# EAGLE design usb_hub (EAGLE 9.6.0)
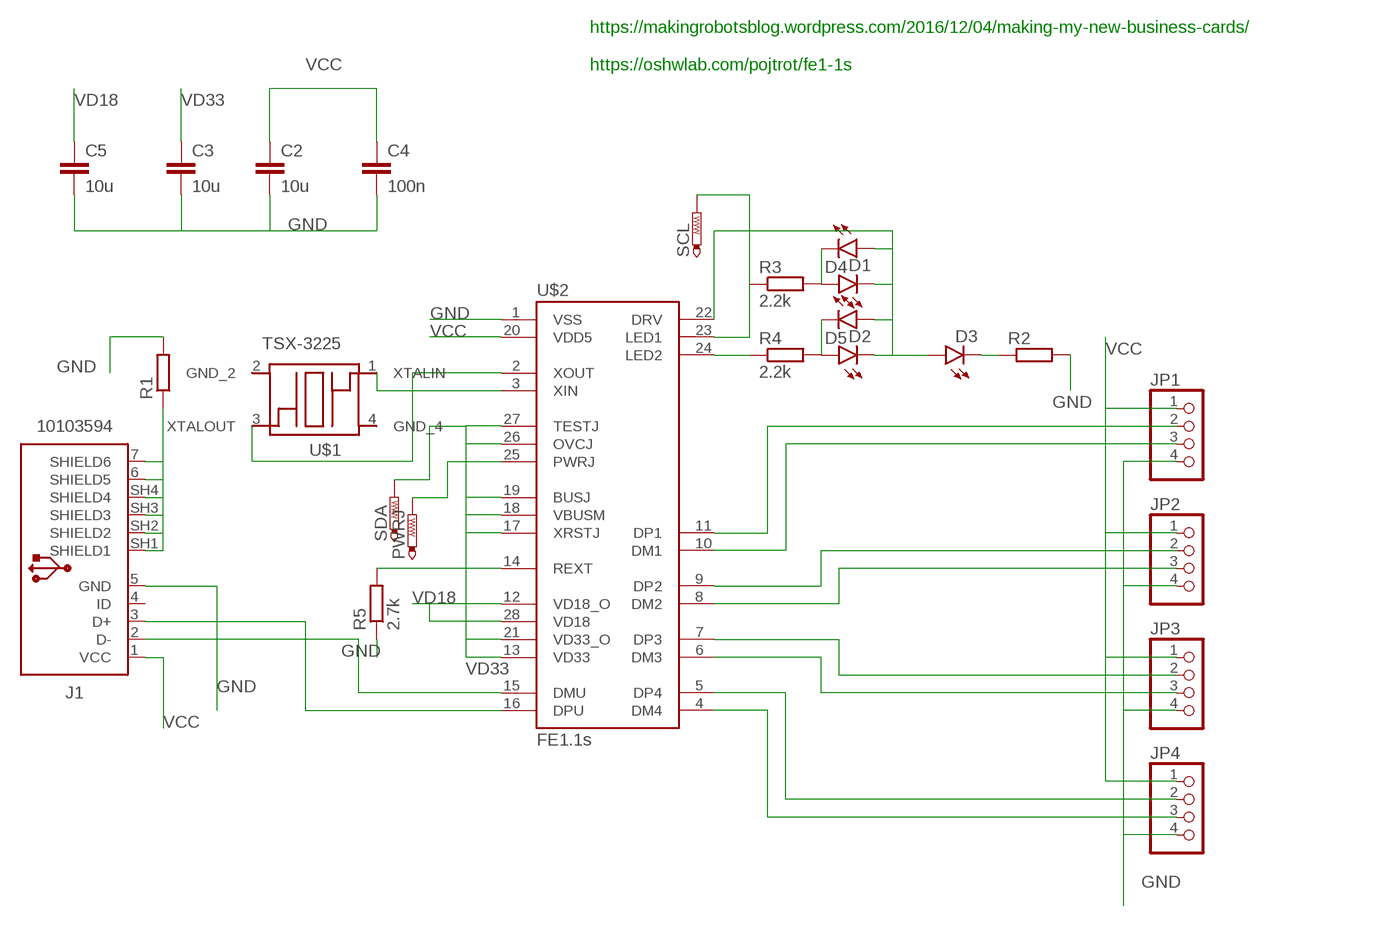
[diagram p0: schematic, sheet 1]

## Parts
C2  10u  C-EUC0805  [C0805]
C3  10u  C-EUC0805  [C0805]
C4  100n  C-EUC0603  [C0603]
C5  10u  C-EUC0805  [C0805]
D1  LEDCHIP-LED0603  [CHIP-LED0603]
D2  LEDCHIP-LED0603  [CHIP-LED0603]
D3  LEDCHIP-LED0603  [CHIP-LED0603]
D4  LEDCHIP-LED0603  [CHIP-LED0603]
D5  LEDCHIP-LED0603  [CHIP-LED0603]
J1  10103594  [10103594]
JP1  PINHD-1X4  [1X04]
JP2  PINHD-1X4  [1X04]
JP3  PINHD-1X4  [1X04]
JP4  PINHD-1X4  [1X04]
PWRJ  PTR1B1,27  [B1,27]
R1  R-EU_R0603  [R0603]
R2  R-EU_R0603  [R0603]
R3  2.2k  R-EU_R0603  [R0603]
R4  2.2k  R-EU_R0603  [R0603]
R5  2.7k  R-EU_R0603  [R0603]
SCL  PTR1B1,27  [B1,27]
SDA  PTR1B1,27  [B1,27]
U$1  TSX-3225  [TSX-3225]
U$2  FE1.1S  [FE1.1S_SSOP-28]

## Nets
GND: C2.2 C3.2 C4.2 C5.2 J1.5(GND) JP1.4 JP2.4 JP3.4 JP4.4 R1.2 R2.2 R5.1 U$2.1(VSS)
N$1: J1.3(D+) U$2.16(DPU)
N$2: J1.2(D-) U$2.15(DMU)
N$3: U$1.1(XTALIN) U$2.3(XIN)
N$4: U$1.3(XTALOUT) U$2.2(XOUT)
N$5: D1.A D4.C R3.2
N$7: D2.A D5.C R4.2
N$8: JP4.3 U$2.4(DM4)
N$9: JP4.2 U$2.5(DP4)
N$10: JP3.3 U$2.6(DM3)
N$11: JP3.2 U$2.7(DP3)
N$12: JP2.3 U$2.8(DM2)
N$13: JP2.2 U$2.9(DP2)
N$14: JP1.3 U$2.10(DM1)
N$15: JP1.2 U$2.11(DP1)
N$16: R4.1 U$2.24(LED2)
N$17: D3.C R2.1
N$18: R3.1 SCL.TP U$2.23(LED1)
N$19: D1.C D2.C D3.A D4.A D5.A U$2.22(DRV)
N$20: PWRJ.TP U$2.25(PWRJ)
N$21: R5.2 U$2.14(REXT)
SHIELD2: J1.6(SHIELD5) J1.7(SHIELD6) J1.SH1(SHIELD1) J1.SH2(SHIELD2) J1.SH3(SHIELD3) J1.SH4(SHIELD4) R1.1
VCC: C2.1 C4.1 J1.1(VCC) JP1.1 JP2.1 JP3.1 JP4.1 U$2.20(VDD5)
VD18: C5.1 U$2.12(VD18_O) U$2.28(VD18)
VD33: C3.1 SDA.TP U$2.13(VD33) U$2.17(XRSTJ) U$2.18(VBUSM) U$2.19(BUSJ) U$2.21(VD33_O) U$2.26(OVCJ) U$2.27(TESTJ)
Unconnected: J1.4(ID) U$1.2(GND_2) U$1.4(GND_4)

## Notes on the sheet
- https://makingrobotsblog.wordpress.com/2016/12/04/making-my-new-business-cards/
  
  https://oshwlab.com/pojtrot/fe1-1s

## Library data of the parts
C2-C5 = rcl:C-EU: CAPACITOR, European symbol; SPICEPREFIX: C
D1-D5 = led:LED: LED OSRAM: - CHIPLED LG R971, LG N971, LY N971, LG Q971, LY Q971, LO R971, LY R971 LH N974, LH R974 LS Q976, LO Q976, LY Q976 LO Q996 - Hyper CHIPLED LW Q18S LB Q993, LB Q99A, LB R99A - SideLED LS A670, LO A670, LY A670, LG A670, LP A670 LB A673, LV A673, LT A673, LW A673 LH A674 LY A675 LS A676, LA A676, LO A676, LY A676, LW A676 LS A679, LY A679, LG A679 - Hyper Micro SIDELED® LS Y876, LA Y876, LO Y876, LY Y876 LT Y87S - SmartLED LW L88C, LW L88S LB L89C, LB L89S, LG L890 LS L89K, LO L89K, LY L89K LS L896, LA L896, LO L896, LY L896 - TOPLED LS T670, LO T670, LY T670, LG T670, LP T670 LSG T670, LSP T670, LSY T670, LOP T670, LYG T670 LG T671, LOG T671, LSG T671 LB T673, LV T673, LT T673, LW T673 LH T674 LS T676, LA T676, LO T676, LY T676, LB T676, LH T676, LSB T676, LW T676 LB T67C, LV T67C, LT T67C, LS T67K, LO T67K, LY T67K, LW E67C LS E67B, LA E67B, LO E67B, LY E67B, LB E67C, LV E67C, LT E67C LW T67C LS T679, LY T679, LG T679 LS T770, LO T770, LY T770, LG T770, LP T770 LB T773, LV T773, LT T773, LW T773 LH T774 LS E675, LA E675, LY E675, LS T675 LS T776, LA T776, LO T776, LY T776, LB T776 LHGB T686 LT T68C, LB T68C - Hyper Mini TOPLED® LB M676 - Mini TOPLED Santana® LG M470 LS M47K, LO M47K, LY M47K Source: http://www.osram.convergy.de LUXEON: - LUMILED® LXK2-PW12-R00, LXK2-PW12-S00, LXK2-PW14-U00, LXK2-PW14-V00 LXK2-PM12-R00, LXK2-PM12-S00, LXK2-PM14-U00 LXK2-PE12-Q00, LXK2-PE12-R00, LXK2-PE12-S00, LXK2-PE14-T00, LXK2-PE14-U00 LXK2-PB12-K00, LXK2-PB12-L00, LXK2-PB12-M00, LXK2-PB14-N00, LXK2-PB14-P00, LXK2-PB14-Q00 LXK2-PR12-L00, LXK2-PR12-M00, LXK2-PR14-Q00, LXK2-PR14-R00 LXK2-PD12-Q00, LXK2-PD12-R00, LXK2-PD12-S00 LXK2-PH12-R00, LXK2-PH12-S00 LXK2-PL12-P00, LXK2-PL12-Q00, LXK2-PL12-R00 Source: www.luxeon.com KINGBRIGHT: KA-3528ASYC Source: www.kingbright.com
J1 = Connector_USB:10103594: USB(2.0) Micro-B, RCPT, 5POS, SMD-THT-R/A Datasheet <https://cdn.amphenol-icc.com/media/wysiwyg/files/documentation/datasheet/inputoutput/io_usb_micro.pdf> Drawing <https://cdn.amphenol-icc.com/media/wysiwyg/files/drawing/10103594.pdf>; CATEGORY: Connectors; CONTACTS: 5; CURRENT-RATING: 1.8A; DESCRIPTION: CONN RCPT USB2.0 MICRO B SMD R/A; GENDER: Receptacle; MANUFACTURER: Amphenol ICC (FCI); MOUNT_TYPE: R/A; MPN: 10103594-0001LF; OPERATING_TEMPERATURE: -30°C ~ 80°C; PART_STATUS: ACTIVE; ROHS_COMPLIANT: COMPLIANT; SUB_CATEGORY: USB; TYPE: USB-micro B; VOLTAGE-RATING: 100VAC
JP1-JP4 = pinhead:PINHD-1X4: PIN HEADER
PWRJ SCL SDA = testpad:PTR1: TEST PIN
R1-R5 = rcl:R-EU_: RESISTOR, European symbol; SPICEPREFIX: R
U$1 = crystals:TSX-3225
U$2 = imcom:FE1.1S: A USB 2.0 hub IC. http://www.jfd-ic.com/Documents/FE1.1s%20Data%20Sheet%20%28Rev.%201.0%29.pdf

## Board
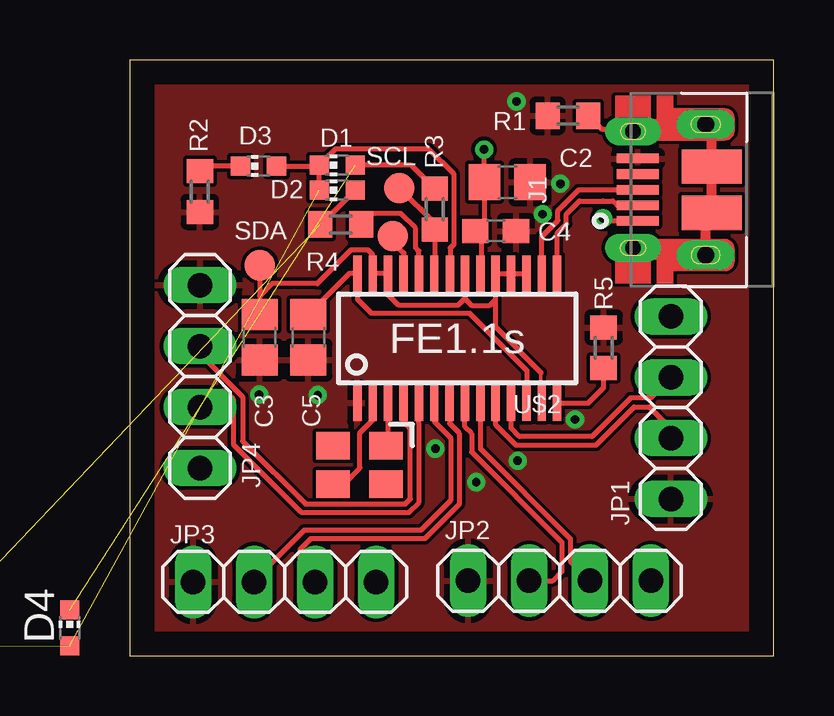
[diagram p1: board, top side]
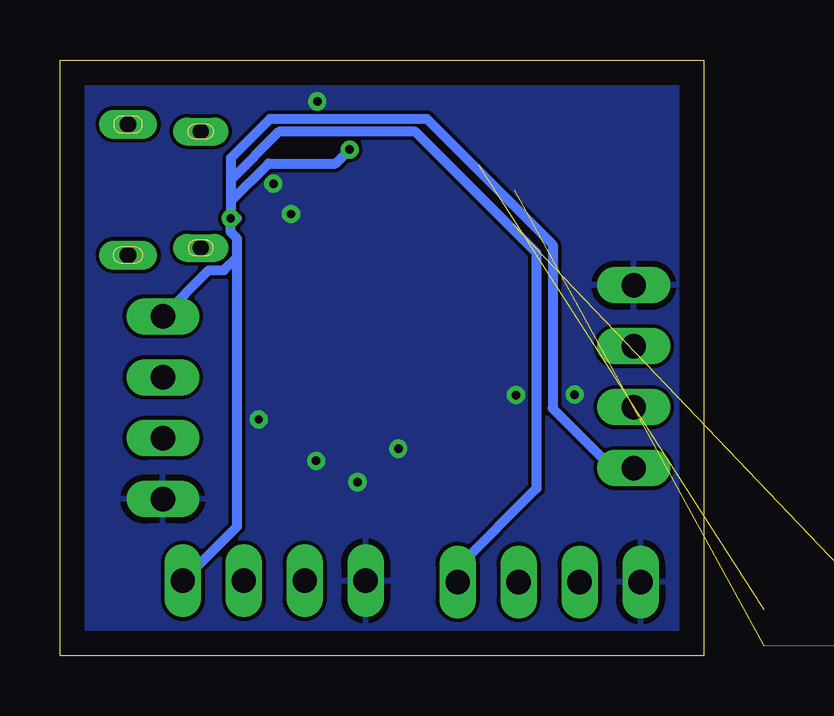
[diagram p2: board, bottom side, seen from below]

Size 26.82 x 24.84 mm. Coordinates in mm from the lower left corner, seen from the top.
Outline: 0,0 26.82,0 26.82,24.84 0,24.84 0,0
Copper layers (1*16): Top 0.035mm / dielectric 1.5mm / Bottom 0.035mm
Design rules "default": minimum track width 6mil, minimum drill 0.35mm, track to track 6mil, track to pad 6mil, pad to pad 6mil, via to via 6mil, smd to smd 6mil, copper to edge 40mil, drill to drill 6mil, minimum pad ring 10mil, minimum via ring 8mil, stop-mask expansion 4mil, vias tented up to drill 0mil, thermal gap 10mil

### Footprints (pad centres in the part's own frame; a part is rotated, then mirrored left to right if it is on the bottom)
C0805 = smd 1.3 x 1.5: 1 -0.95,0; 2 0.95,0
C0603 = smd 1.1 x 1: 1 -0.85,0; 2 0.85,0
CHIP-LED0603 = smd 0.8 x 0.8: A 0,-0.75; C 0,0.75
10103594 = smd 0.4 x 1.75: 1 -1.3,2.825; 2 -0.65,2.825; 3 0,2.825; 4 0.65,2.825; 5 1.3,2.825 | smd 1.425 x 2.5: 6 -0.963,-0.25; 7 0.963,-0.25 | drill 0.65 pad 0.73 long: SH1 -2.425,3.03; SH2 2.425,3.03 | drill 0.7 long: SH3 -2.725,0; SH4 2.725,0
1X04 = drill 1.016 long: 1 -3.81,0; 2 -1.27,0; 3 1.27,0; 4 3.81,0
B1,27 = smd 1.27 x 1.27: TP 0,0
R0603 = smd 1 x 1.1: 1 -0.85,0; 2 0.85,0
TSX-3225 = smd 1.4 x 1.15: 1 0,-1.6; 2 2.2,-1.6; 3 2.2,0; 4 0,0
FE1.1S_SSOP-28 = smd 0.35 x 1.5: 1 -4.16,-2.7; 2 -3.52,-2.7; 3 -2.88,-2.7; 4 -2.24,-2.7; 5 -1.6,-2.7; 6 -0.96,-2.7; 7 -0.32,-2.7; 8 0.32,-2.7; 9 0.96,-2.7; 10 1.6,-2.7; 11 2.24,-2.7; 12 2.88,-2.7; 13 3.52,-2.7; 14 4.16,-2.7; 15 4.16,2.7; 16 3.52,2.7; 17 2.88,2.7; 18 2.24,2.7; 19 1.6,2.7; 20 0.96,2.7; 21 0.32,2.7; 22 -0.3,2.7; 23 -0.96,2.7; 24 -1.6,2.7; 25 -2.24,2.7; 26 -2.88,2.7; 27 -3.52,2.7; 28 -4.16,2.7

### Placement (x,y rotation side)
C2  15.72,19.74 0 top
C3  5.4,13.28 270 top
C4  15.24,17.71 0 top
C5  7.44,13.28 270 top
D1  8.63,20.45 90 top
D2  8.63,19.41 90 top
D3  5.35,20.42 90 top
D4  -2.51,1.17 0 top
D5  -7.39,1.14 0 top  (outside the outline)
J1  23.99,19.43 90 top
JP1  22.54,10.34 270 top
JP2  17.9,3.13 180 top
JP3  6.44,3.08 180 top
JP4  2.92,11.64 90 top
PWRJ  10.95,17.5 0 top
R1  18.25,22.52 180 top
R2  2.91,19.35 270 top
R3  12.7,18.62 90 top
R4  8.78,17.98 180 top
R5  19.74,12.85 270 top
SCL  11.23,19.51 0 top
SDA  5.41,16.28 90 top
U$1  10.67,7.15 180 top
U$2  13.64,13.24 0 top

### Tracks (layer width: path | path; a pad name or v marks a point on that pad's centre or on a via)
GND  (via drill 0.35)
  Top 0.203: 16.12,23.13 v16.1,23.11 | C5.2 7.82,11.95
  other vias: 7.82,10.87 5.38,10.89 17.2,18.42 17.93,19.68 12.73,8.64 14.43,7.24 16.15,8.13 18.54,9.86
  pour Bottom: 0,0 0,24.84 26.82,24.84 26.82,0
  pour Top: 0,0 0,24.84 26.82,24.84 26.82,0
N$1
  Top 0.203: U$2.16 17.16,17.48 17.83,18.16 17.83,18.57 18.7,19.43 J1.3
N$2
  Top 0.203: U$2.15 17.8,17.62 18.18,18.01 18.18,18.42 18.73,18.96 19.71,18.96 20.12,18.96 20.3,18.78 J1.2
N$3
  Top 0.203: U$2.3 10.74,10.52 10.74,8.83 U$1.1
N$4
  Top 0.152: 10.12,9.83 U$2.2
  Top 0.203: U$1.3 8.9,7.15 9.59,7.84 9.59,9.3 10.12,9.83
N$5  (1 unrouted)
  Top 0.203: R3.2 11.72,20.45 D1.A
N$7  (1 unrouted)
  Top 0.203: R4.2 7.95,17.98 D2.A
N$8
  Top 0.203: U$2.4 11.41,9.76 11.68,9.48 11.68,6.54 11.47,6.33 7.32,6.33 4.7,8.94 4.7,10.8 2.92,12.58 JP4.3
N$9
  Top 0.203: U$2.5 12.04,9.68 12.05,9.67 12.05,6.4 11.62,5.97 7.14,5.97 4.32,8.79 4.32,10.68 3.97,11.02 3.3,11.02 2.92,10.64 JP4.2
N$10
  Top 0.203: U$2.6 12.69,9.76 13.36,9.09 13.36,6.48 12.12,5.24 7.26,5.24 5.17,3.16 JP3.3
N$11
  Top 0.203: U$2.7 13.32,9.68 13.72,9.28 13.72,6.3 12.29,4.88 7.53,4.88 7.08,4.43 7.08,3.71 JP3.2
N$12
  Top 0.203: JP2.3 17.62,3.13 18,3.51 18,4.73 14.24,8.49 14.24,9.27 13.96,9.55 U$2.8
N$13
  Top 0.203: JP2.2 18.36,3.94 18.36,4.88 14.6,8.64 U$2.9
N$14
  Top 0.203: U$2.10 15.24,9.63 16.08,8.79 19.42,8.79 21.01,10.38 21.64,10.38 22.54,9.48 JP1.3
N$15
  Top 0.152: JP1.2 22.54,11.59
  Top 0.203: 22.54,11.59 21.7,10.75 20.86,10.75 19.26,9.14 16.23,9.14 15.88,9.5 U$2.11
N$16
  Top 0.203: U$2.24 12.04,16.88 11.9,17.02 11.9,17.83 11.29,18.44 10.09,18.44 R4.1
N$17
  Top 0.203: D3.C 3.24,20.42 R2.1
N$18
  Top 0.152: 12.7,15.96 U$2.23
  Top 0.203: 12.7,15.96 R3.1 12.7,18.04 SCL.TP
N$19  (2 unrouted)
  Top 0.203: U$2.22 13.34,17 13.5,17.17 13.5,20.08 12.45,21.13 8.56,21.13 D1.C | D1.C 7.88,20.27 7.73,20.42 D3.A | D2.C D1.C
N$20
  Top 0.203: U$2.25 11.42,15.96 11.42,16.8 10.95,17.26 PWRJ.TP
N$21
  Top 0.203: U$2.14 19.1,10.54 19.74,11.18 R5.2
SHIELD2
  Top 0.152: R1.1
  Top 0.203: R1.1 19.66,21.96 21.07,21.96
  Top 0.406: J1.SH1 21.26,16.71 J1.SH3 23.99,18.22 J1.6 J1.7 24.24,21.91 J1.SH4 21.26,22.16 21.07,21.96 J1.SH2
VCC  (via drill 0.35)
  Top 0.152: 14.63,15.97 U$2.20 | 14.77,18.09 C4.1 14.63,17.47
  Top 0.203: 14.77,18.09 C2.1 14.77,21.09 v14.76,21.11 | 14.63,17.47 14.63,15.97 | v19.71,18.24 19.71,18.16 | 19.71,18.16 19.71,18.14 | J1.1 19.74,18.13 19.71,18.16
  Bottom 0.406: JP4.1 3.81,7.83 6.3,10.31 6.3,17.14 11.53,22.38 18.09,22.38 19.71,20.75 19.71,19.84 | JP3.1 10.25,3.69 6.98,6.97 6.98,16.81 12.02,21.84 17.7,21.84 19.71,19.84 | v19.71,18.24 19.71,18.95 18.14,20.52 15.34,20.52 v14.76,21.11 | 19.71,19.84 v19.71,18.24 | 19.45,18.24 v19.71,18.24 | JP2.1 19.45,5.39 19.45,16.62 | JP1.1 20.62,16.07 20,16.07 19.45,16.62 | 19.45,16.62 19.45,17.39 19.71,17.66 v19.71,18.24
VD18
  Top 0.203: C5.1 9.14,15.94 U$2.28 9.49,14.86 10.07,14.28 14.16,14.28 16.54,11.9 16.54,10.56 U$2.12
VD33
  Top 0.152: U$2.27 | 15.24,14.86 U$2.19 | 17.12,11.79 17.12,10.57 U$2.13
  Top 0.203: U$2.27 10.11,16.73 9.93,16.92 9.21,16.92 7.81,15.52 5.92,15.52 5.4,15.01 C3.1 SDA.TP | U$2.21 13.96,14.9 | 13.96,14.9 14.25,14.61 14.99,14.61 15.24,14.86 | 13.96,14.9 13.67,14.61 11.2,14.61 10.76,15.05 U$2.26 U$2.27 | 17.12,11.79 17.12,11.82 15.24,13.7 U$2.19 U$2.18 U$2.17